# EAGLE design napeti (EAGLE 9.5.0)
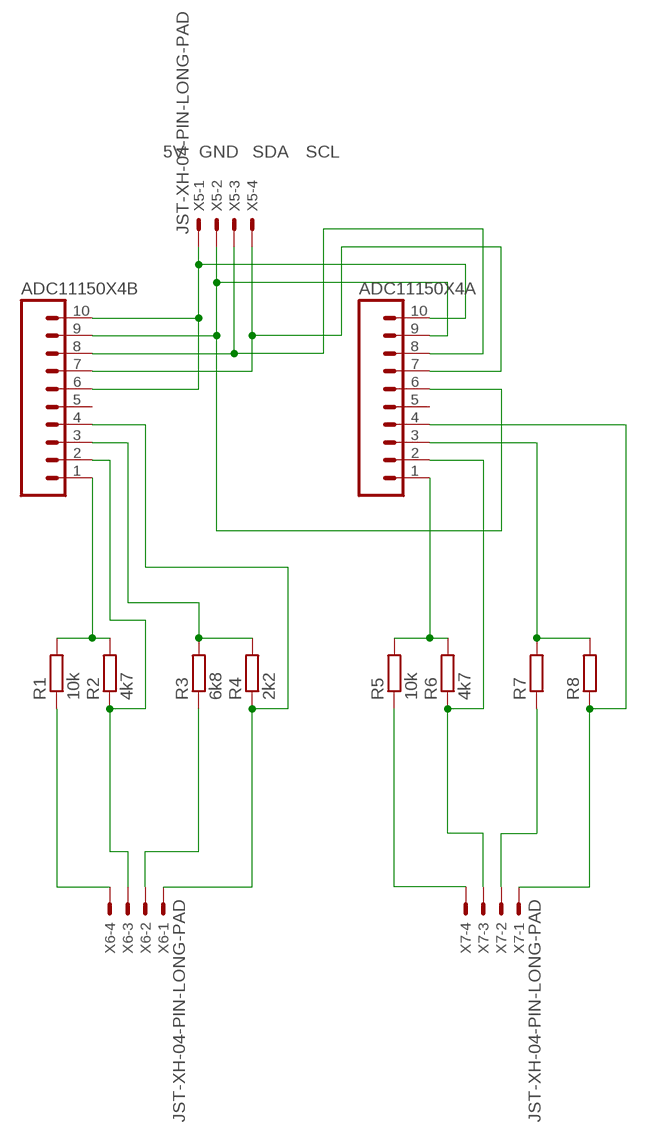
[diagram p0: schematic, sheet 1]

## Parts
ADC11150X4A  M10  [10P]
ADC11150X4B  M10  [10P]
R1  10k  R-EU_0204/7  [0204/7]
R2  4k7  R-EU_0204/7  [0204/7]
R3  6k8  R-EU_0204/7  [0204/7]
R4  2k2  R-EU_0204/7  [0204/7]
R5  10k  R-EU_0204/7  [0204/7]
R6  4k7  R-EU_0204/7  [0204/7]
R7  R-EU_0204/7  [0204/7]
R8  R-EU_0204/7  [0204/7]
X5  JST-XH-04-PIN-LONG-PAD  [JST-XH-04-PACKAGE-LONG-PAD]
X6  JST-XH-04-PIN-LONG-PAD  [JST-XH-04-PACKAGE-LONG-PAD]
X7  JST-XH-04-PIN-LONG-PAD  [JST-XH-04-PACKAGE-LONG-PAD]

## Nets
5V: ADC11150X4A.10 ADC11150X4B.6 ADC11150X4B.10 X5.1
GND: ADC11150X4A.6 ADC11150X4A.9 ADC11150X4B.9 X5.2
N$1: ADC11150X4A.1 R5.2 R6.2
N$2: R1.1 X6.4
N$3: ADC11150X4A.2 R6.1 X7.3
N$4: ADC11150X4A.3 R7.2 R8.2
N$5: R3.1 X6.2
N$6: ADC11150X4A.4 R8.1 X7.1
N$7: R5.1 X7.4
N$8: R7.1 X7.2
N$9: ADC11150X4B.1 R1.2 R2.2
N$10: ADC11150X4B.2 R2.1 X6.3
N$13: ADC11150X4B.3 R3.2 R4.2
N$14: ADC11150X4B.4 R4.1 X6.1
SCL: ADC11150X4A.7 ADC11150X4B.7 X5.4
SDA: ADC11150X4A.8 ADC11150X4B.8 X5.3
Unconnected: ADC11150X4A.5 ADC11150X4B.5

## Library data of the parts
ADC11150X4A ADC11150X4B = con-amp-quick:M10: AMP QUICK CONNECTOR; OC_FARNELL: unknown; OC_NEWARK: unknown
R1-R8 = rcl:R-EU_: RESISTOR, European symbol; SPICEPREFIX: R
X5-X7 = Rembrandt:JST-XH-04-PIN: JST XH Connector 2 Pin Wire to board connector. Pitch: 2,54 mm, (0.100") Number of pins: 4 Created by Rembrandt Electronics www.rembrandtelectronics.com

## Board
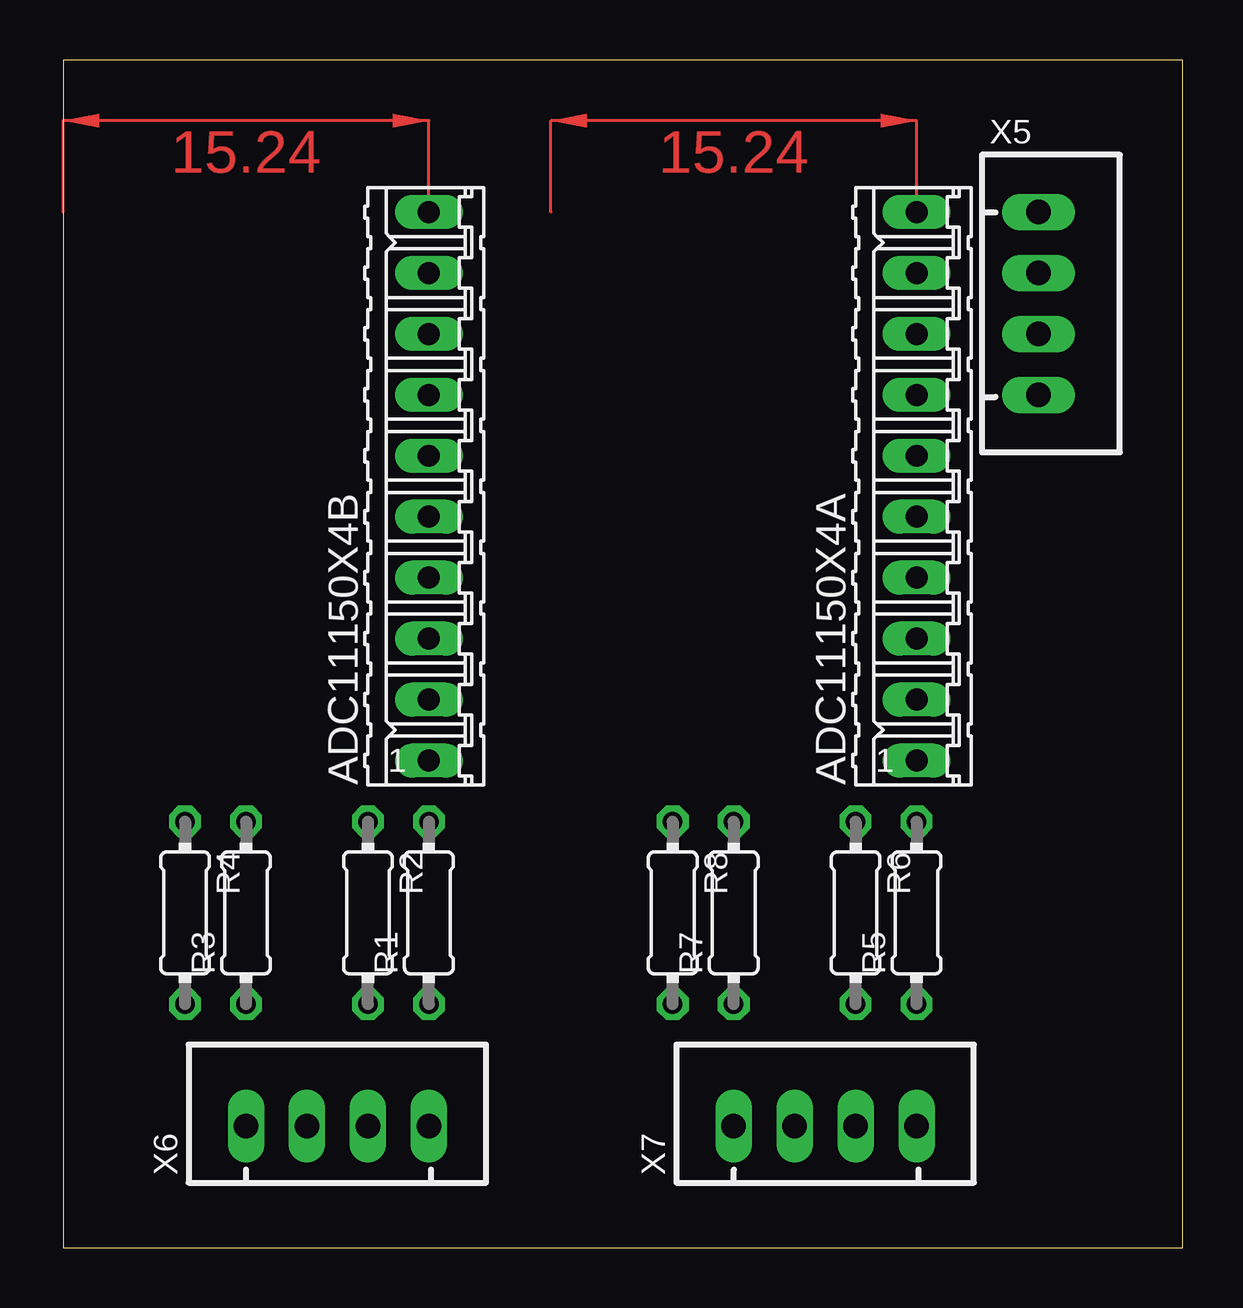
[diagram p1: board, top side]
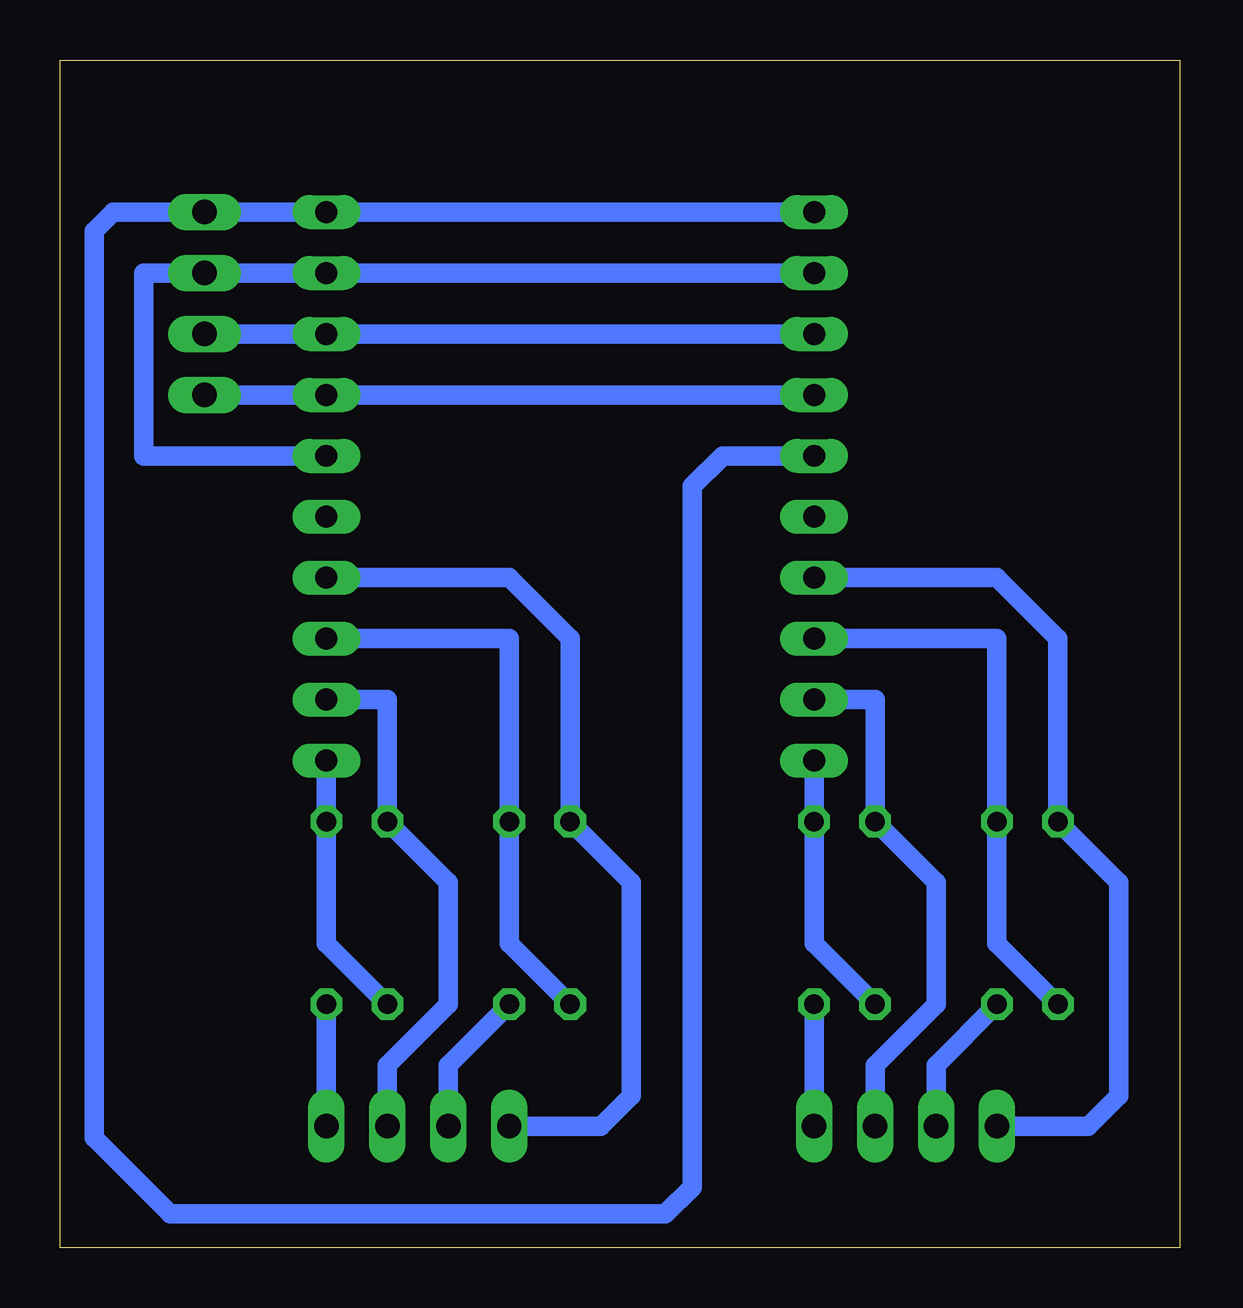
[diagram p2: board, bottom side, seen from below]

Size 46.66 x 49.52 mm. Coordinates in mm from the lower left corner, seen from the top.
Outline: 0,0 46.66,0 46.66,49.52 0,49.52 0,0
Copper layers (1*16): Top 0.035mm / dielectric 1.5mm / Bottom 0.035mm
Design rules "default": minimum track width 6mil, minimum drill 0.35mm, track to track 6mil, track to pad 6mil, pad to pad 6mil, via to via 6mil, smd to smd 6mil, copper to edge 40mil, drill to drill 6mil, minimum pad ring 10mil, minimum via ring 8mil, stop-mask expansion 4mil, vias tented up to drill 0mil, thermal gap 10mil

### Footprints (pad centres in the part's own frame; a part is rotated, then mirrored left to right if it is on the bottom)
10P = drill 0.914 long: 1 -11.43,0; 2 -8.89,0; 3 -6.35,0; 4 -3.81,0; 5 -1.27,0; 6 1.27,0; 7 3.81,0; 8 6.35,0; 9 8.89,0; 10 11.43,0
0204/7 = drill 0.813 octagon: 1 -3.81,0; 2 3.81,0
JST-XH-04-PACKAGE-LONG-PAD = drill 1.016 long: 1 -3.81,0; 2 -1.27,0; 3 1.27,0; 4 3.81,0

### Placement (x,y rotation side)
ADC11150X4A  35.56,31.75 90 top
ADC11150X4B  15.24,31.75 90 top
R1  15.24,13.97 90 top
R2  12.7,13.97 270 top
R3  7.62,13.97 90 top
R4  5.08,13.97 270 top
R5  35.56,13.97 90 top
R6  33.02,13.97 270 top
R7  27.94,13.97 90 top
R8  25.4,13.97 270 top
X5  40.64,39.37 270 top
X6  11.43,5.08 0 top
X7  31.75,5.08 0 top

### Tracks (layer width: path | path; a pad name or v marks a point on that pad's centre or on a via)
5V
  Bottom 0.813: ADC11150X4B.10 ADC11150X4A.10 X5.1 44.45,43.18 45.24,42.39 45.24,4.6 42.06,1.42 21.44,1.42 20.32,2.54 20.32,31.75 19.05,33.02 ADC11150X4B.6
GND
  Bottom 0.813: ADC11150X4B.9 ADC11150X4A.9 X5.2 43.18,40.64 43.18,33.02 ADC11150X4A.6
N$1
  Bottom 0.813: R6.2 35.56,12.7 R5.2 ADC11150X4A.1
N$2
  Bottom 0.813: X6.4 R1.1
N$3
  Bottom 0.813: ADC11150X4A.2 33.02,22.86 R6.1 30.48,15.24 30.48,10.16 33.02,7.62 X7.3
N$4
  Bottom 0.813: R8.2 27.94,12.7 R7.2 27.94,25.4 ADC11150X4A.3
N$5
  Bottom 0.813: X6.2 10.16,7.62 R3.1
N$6
  Bottom 0.813: ADC11150X4A.4 27.94,27.94 25.4,25.4 R8.1 22.86,15.24 22.86,6.35 24.13,5.08 X7.1
N$7
  Bottom 0.813: R5.1 X7.4
N$8
  Bottom 0.813: X7.2 30.48,7.62 R7.1
N$9
  Bottom 0.813: R2.2 15.24,12.7 R1.2 ADC11150X4B.1
N$10
  Bottom 0.813: ADC11150X4B.2 12.7,22.86 R2.1 10.16,15.24 10.16,10.16 12.7,7.62 X6.3
N$13
  Bottom 0.813: R4.2 7.62,12.7 R3.2 7.62,25.4 ADC11150X4B.3
N$14
  Bottom 0.813: ADC11150X4B.4 7.62,27.94 5.08,25.4 R4.1 2.54,15.24 2.54,6.35 3.81,5.08 X6.1
SCL
  Bottom 0.813: ADC11150X4B.7 ADC11150X4A.7 X5.4
SDA
  Bottom 0.813: ADC11150X4B.8 ADC11150X4A.8 X5.3
(copper drawn outside any net)
  shapes: Top area x2